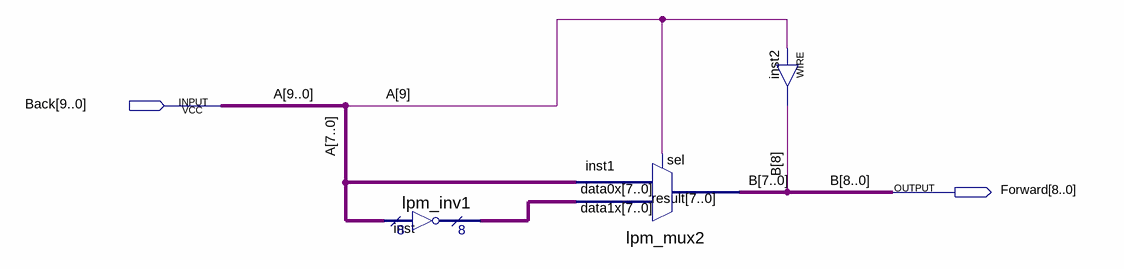
[diagram p0: schematic sheet]
// Quartus schematic B10toF9.bdf as structural Verilog: 3 symbols, 2 pins
module B10toF9 (
  input  [9:0] Back,
  output [8:0] Forward
);

  wire [7:0] inst_result;

  lpm_inv1 inst (.data(Back[7:0]), .result(inst_result));
  lpm_mux2 inst1 (.data1x(inst_result), .data0x(Back[7:0]), .sel(Back[9]), .result(Forward[7:0]));
  assign Forward[8] = Back[9];  // WIRE inst2

  // Other names for the same wires on the sheet: A[9:0] = Back; B[8:0] = Forward
endmodule
